# Altium schematic sheet 3-GPIO.SchDoc
size 420 x 297 mm; Engineer: Иванов; DocumentNumber: GPIO; SheetNumber: 3; SheetTotal: 4
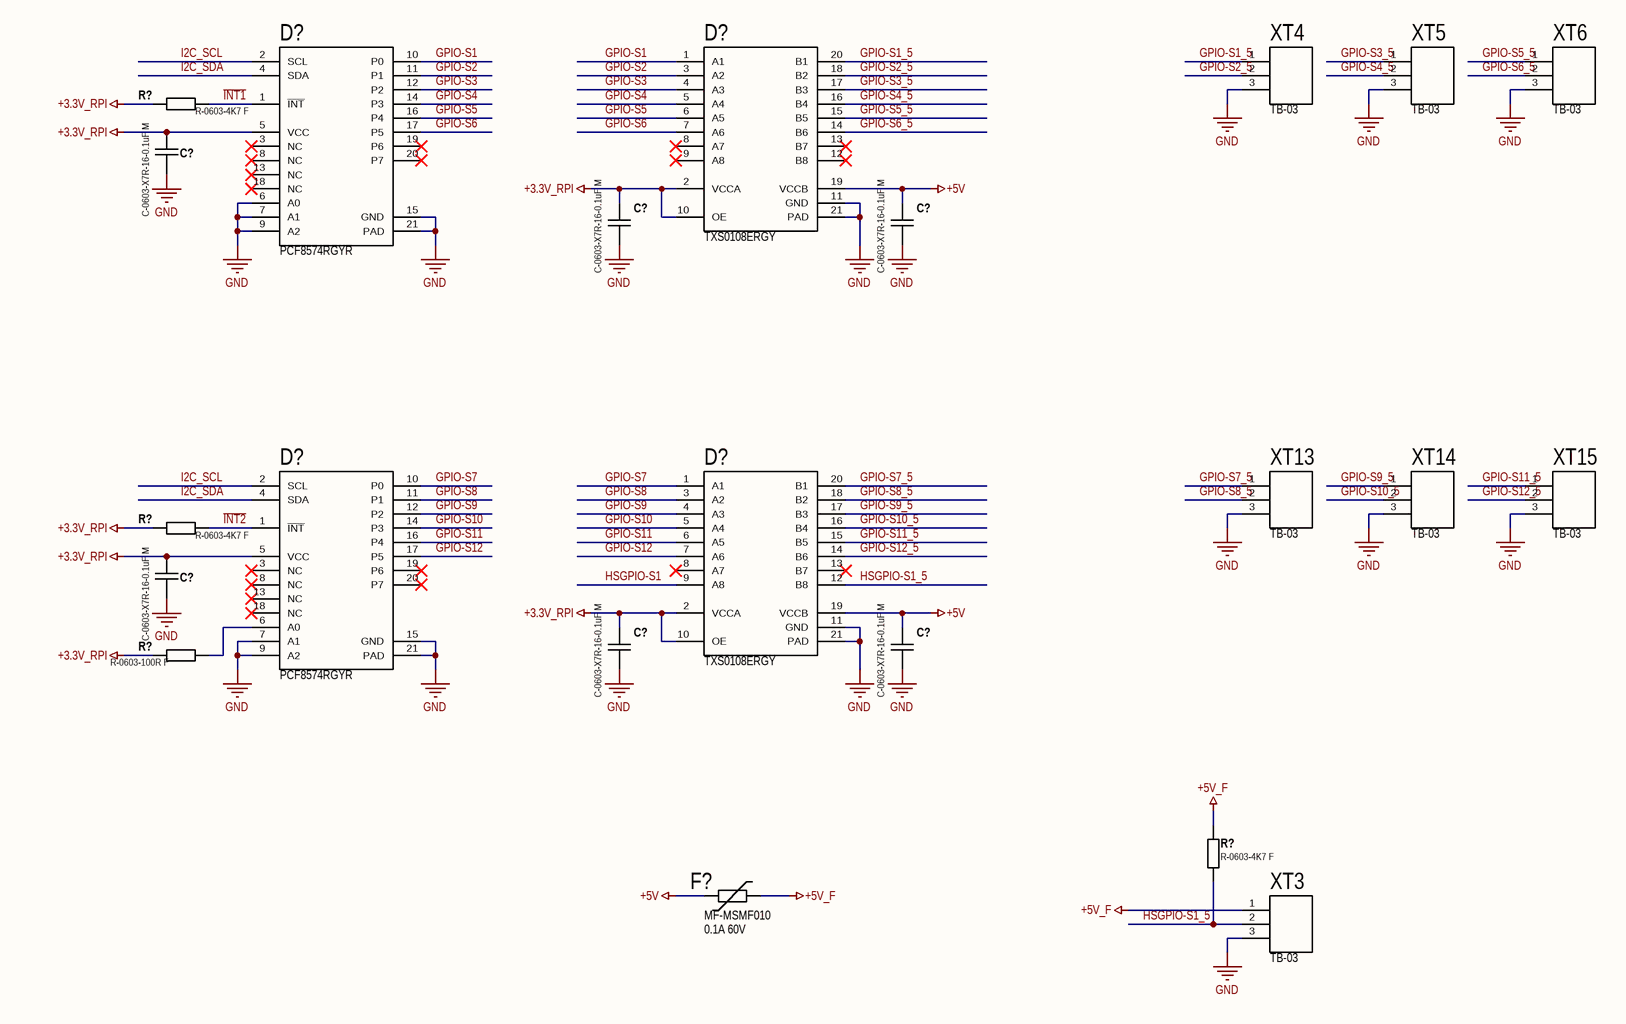
[diagram p0: 3-GPIO.SchDoc]

## Parts
(Parts that share a designator on the sheet are numbered #1, #2 ... from top to bottom, then left to right.)
C?#1  C-0603-X7R-16-0.1uF M  [CAPC160X80X100L35N]
C?#2  C-0603-X7R-16-0.1uF M  [CAPC160X80X100L35N]
C?#3  C-0603-X7R-16-0.1uF M  [CAPC160X80X100L35N]
C?#4  C-0603-X7R-16-0.1uF M  [CAPC160X80X100L35N]
C?#5  C-0603-X7R-16-0.1uF M  [CAPC160X80X100L35N]
C?#6  C-0603-X7R-16-0.1uF M  [CAPC160X80X100L35N]
D?#1  PCF8574RGYR
D?#2  TXS0108ERGY  [QFN21P50_450X350X100L40X24T305X205N]
D?#3  PCF8574RGYR
D?#4  TXS0108ERGY  [QFN21P50_450X350X100L40X24T305X205N]
F?  MF-MSMF010  value 0.1A 60V
R?#1  R-0603-4K7 F  [RESC160X80X55L30N]
R?#2  R-0603-4K7 F  [RESC160X80X55L30N]
R?#3  R-0603-100R F  [RESC160X80X55L30N]
R?#4  R-0603-4K7 F  [RESC160X80X55L30N]
XT3  TB-03  [HDRV3W63P254_3X1_762X571H1144]
XT4  TB-03  [HDRV3W63P254_3X1_762X571H1144]
XT5  TB-03  [HDRV3W63P254_3X1_762X571H1144]
XT6  TB-03  [HDRV3W63P254_3X1_762X571H1144]
XT13  TB-03  [HDRV3W63P254_3X1_762X571H1144]
XT14  TB-03  [HDRV3W63P254_3X1_762X571H1144]
XT15  TB-03  [HDRV3W63P254_3X1_762X571H1144]

## Nets
+3.3V_RPI: C?#1.1 C?#2.1 C?#4.1 C?#5.1 D?#1.5(VCC) D?#2.2(VCCA) D?#2.10(OE) D?#3.5(VCC) D?#4.2(VCCA) D?#4.10(OE) R?#1.2 R?#2.2 R?#3.2
+5V: C?#3.1 C?#6.1 D?#2.19(VCCB) D?#4.19(VCCB) F?.1
+5V_F: F?.2 R?#4.1 XT3.1
GND: C?#1.2 C?#2.2 C?#3.2 C?#4.2 C?#5.2 C?#6.2 D?#1.6(A0) D?#1.7(A1) D?#1.9(A2) D?#1.15(GND) D?#1.21(PAD) D?#2.11(GND) D?#2.21(PAD) D?#3.7(A1) D?#3.9(A2) D?#3.15(GND) D?#3.21(PAD) D?#4.11(GND) D?#4.21(PAD) XT3.3 XT4.3 XT5.3 XT6.3 XT13.3 XT14.3 XT15.3
GPIO-S1: D?#1.10(P0) D?#2.1(A1)
GPIO-S1_5: D?#2.20(B1) XT4.1
GPIO-S2: D?#1.11(P1) D?#2.3(A2)
GPIO-S2_5: D?#2.18(B2) XT4.2
GPIO-S3: D?#1.12(P2) D?#2.4(A3)
GPIO-S3_5: D?#2.17(B3) XT5.1
GPIO-S4: D?#1.14(P3) D?#2.5(A4)
GPIO-S4_5: D?#2.16(B4) XT5.2
GPIO-S5: D?#1.16(P4) D?#2.6(A5)
GPIO-S5_5: D?#2.15(B5) XT6.1
GPIO-S6: D?#1.17(P5) D?#2.7(A6)
GPIO-S6_5: D?#2.14(B6) XT6.2
GPIO-S7: D?#3.10(P0) D?#4.1(A1)
GPIO-S7_5: D?#4.20(B1) XT13.1
GPIO-S8: D?#3.11(P1) D?#4.3(A2)
GPIO-S8_5: D?#4.18(B2) XT13.2
GPIO-S9: D?#3.12(P2) D?#4.4(A3)
GPIO-S9_5: D?#4.17(B3) XT14.1
GPIO-S10: D?#3.14(P3) D?#4.5(A4)
GPIO-S10_5: D?#4.16(B4) XT14.2
GPIO-S11: D?#3.16(P4) D?#4.6(A5)
GPIO-S11_5: D?#4.15(B5) XT15.1
GPIO-S12: D?#3.17(P5) D?#4.7(A6)
GPIO-S12_5: D?#4.14(B6) XT15.2
HSGPIO-S1: D?#4.9(A8)
HSGPIO-S1_5: D?#4.12(B8) R?#4.2 XT3.2
I2C_SCL: D?#1.2(SCL) D?#3.2(SCL)
I2C_SDA: D?#1.4(SDA) D?#3.4(SDA)
~{INT1}: D?#1.1(~{INT}) R?#1.1
~{INT2}: D?#3.1(~{INT}) R?#2.1
NetD?#3_6: D?#3.6(A0) R?#3.1

Not connected (* = marked no-connect by the designer): D?#1 3(NC)* 8(NC)* 13(NC)* 18(NC)* 19(P6)* 20(P7)*; D?#2 8(A7)* 9(A8)* 12(B8)* 13(B7)*; D?#3 3(NC)* 8(NC)* 13(NC)* 18(NC)* 19(P6)* 20(P7)*; D?#4 8(A7)* 13(B7)*

## Notes on the sheet
- Подп. и дата
- Инв.№ дубл.
- Взам.инв.№
- Подп.и дата
- Инв.№ подл.
- Изм.
- Лист
- № докум.
- Подп.
- Дата
- Копировал
- Формат  A3

## Library data of the parts
C?#1-C?#6 = C: General capacitor; Manufacturer: Murata; Component_Type: Конденсатор; Mount_Type: SMD; Tolerance: 20%; Voltage: 16V; Value: 0.1uF; TC: X7R; Partnumber: *; PnP_Name: C-0603-X7R-16-0.1uF M; Size: 0603; UID: C-0603-X7R-16-0.1uF M
D?#1 D?#3 = PCF8574RGYR: PCF8574 Remote 8-Bit I/O Expander for I2C Bus; Manufacturer: Texas Instruments; Component_Type: Микросхема; Mount_Type: Auto; PnP_Name: D-PCF8574RGYR; Partnumber: PCF8574RGYR; UID: D-PCF8574RGYR
D?#2 D?#4 = TXS0108E: 8-Bit Bi-directional, Level-Shifting, Voltage Translator for Open-Drain and Push-Pull Applications; Manufacturer: Texas Instruments; Component_Type: Микросхема; Mount_Type: Auto; Partnumber: TXS0108ERGY; UID: D-TXS0108ERGY
F? = R_T: Multifuse; Manufacturer: Bourns; Mount_Type: Auto; Component_Type: Предохранитель; PnP_Name: F-MF-MSMF010; Partnumber: MF-MSMF010; Tolerance: -; Size: -; UID: F-MF-MSMF010; TC: -
R?#1 R?#2 R?#4 = R: General resistor; Manufacturer: Yageo; Mount_Type: Auto; Component_Type: Резистор; Tolerance: 1%; Value: 4.7k; Partnumber: *; Size: 0603; PnP_Name: R-0603-4K7 F; UID: R-0603-4K7 F; TC: -
R?#3 = R: General resistor; Manufacturer: Yageo; Mount_Type: Auto; Component_Type: Резистор; Tolerance: 1%; Value: 100; Partnumber: *; Size: 0603; PnP_Name: R-0603-100R F; UID: R-0603-100R F; TC: -
XT3-XT6 XT13-XT15 = Conn_3: Manufacturer: KLS; Component_Type: Клеммник; Mount_Type: Manual; Partnumber: TB-03; UID: X-TB-03